# EAGLE design LuMini_1Inch (EAGLE 9.1.0)
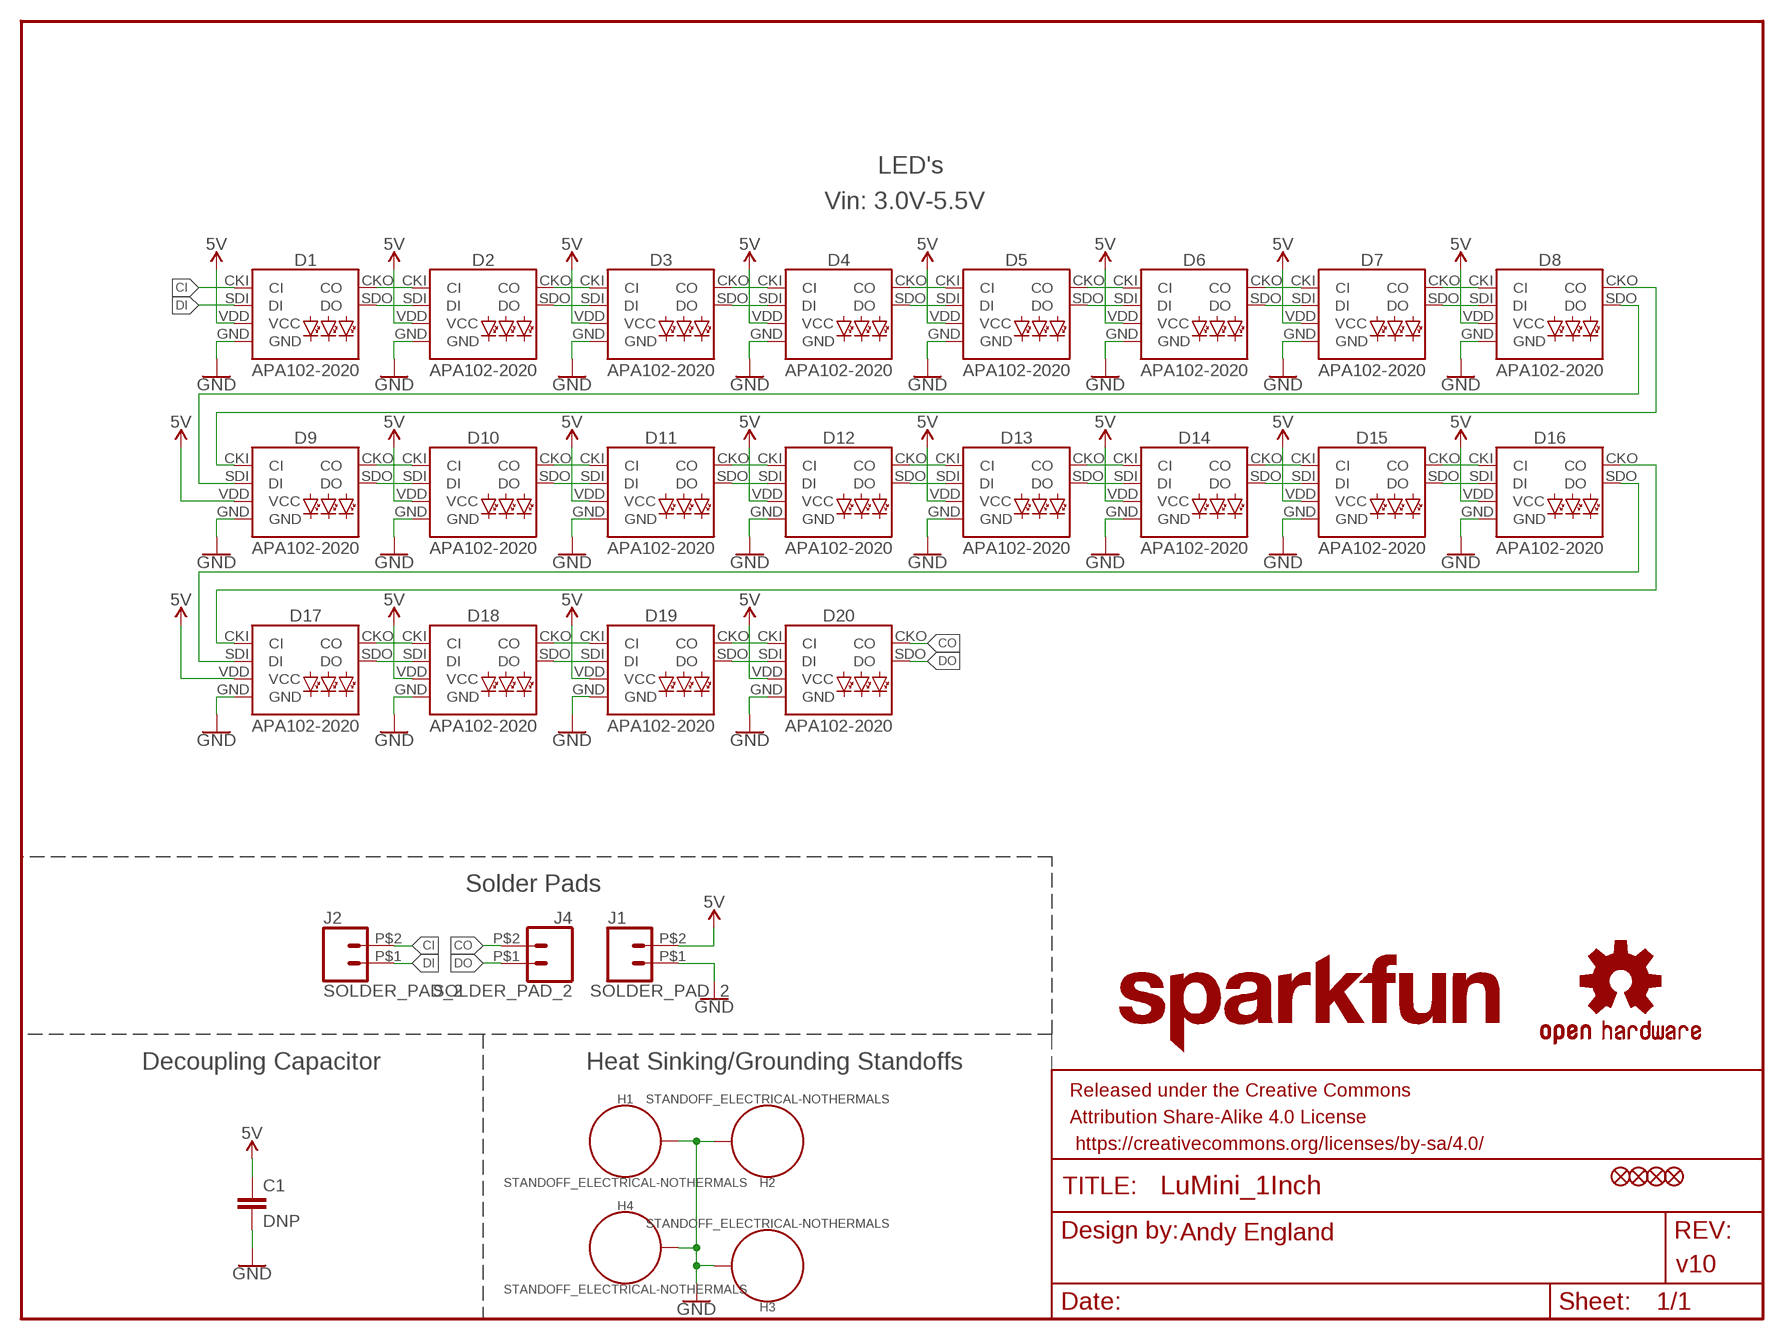
[diagram p0: schematic, sheet 1]

## Parts
C1  DNP  4.7UF-0603-6.3V-(10%)  [0603]
D1  APA102-2020  [APA102-2020]
D2  APA102-2020  [APA102-2020]
D3  APA102-2020  [APA102-2020]
D4  APA102-2020  [APA102-2020]
D5  APA102-2020  [APA102-2020]
D6  APA102-2020  [APA102-2020]
D7  APA102-2020  [APA102-2020]
D8  APA102-2020  [APA102-2020]
D9  APA102-2020  [APA102-2020]
D10  APA102-2020  [APA102-2020]
D11  APA102-2020  [APA102-2020]
D12  APA102-2020  [APA102-2020]
D13  APA102-2020  [APA102-2020]
D14  APA102-2020  [APA102-2020]
D15  APA102-2020  [APA102-2020]
D16  APA102-2020  [APA102-2020]
D17  APA102-2020  [APA102-2020]
D18  APA102-2020  [APA102-2020]
D19  APA102-2020  [APA102-2020]
D20  APA102-2020  [APA102-2020]
FD1  FIDUCIALUFIDUCIAL  [FIDUCIAL-MICRO]
FD2  FIDUCIALUFIDUCIAL  [FIDUCIAL-MICRO]
FD3  FIDUCIALUFIDUCIAL  [FIDUCIAL-MICRO]
FD4  FIDUCIALUFIDUCIAL  [FIDUCIAL-MICRO]
FRAME1  FRAME-LETTER  [CREATIVE_COMMONS]
H1  STANDOFF_ELECTRICAL-NOTHERMALS  [STANDOFF-ELECTRICAL-NOTHERMALS]
H2  STANDOFF_ELECTRICAL-NOTHERMALS  [STANDOFF-ELECTRICAL-NOTHERMALS]
H3  STANDOFF_ELECTRICAL-NOTHERMALS  [STANDOFF-ELECTRICAL-NOTHERMALS]
H4  STANDOFF_ELECTRICAL-NOTHERMALS  [STANDOFF-ELECTRICAL-NOTHERMALS]
J1  SOLDER_PAD_2  [SOLDER_PAD_2]
J2  SOLDER_PAD_2  [SOLDER_PAD_2]
J4  SOLDER_PAD_2  [SOLDER_PAD_2]
LOGO1  SFE_LOGO_NAME.1_INCH  [SFE_LOGO_NAME_.1]
LOGO2  OSHW-LOGOS  [OSHW-LOGO-S]

## Nets
5V: C1.1 D1.VDD(VCC) D2.VDD(VCC) D3.VDD(VCC) D4.VDD(VCC) D5.VDD(VCC) D6.VDD(VCC) D7.VDD(VCC) D8.VDD(VCC) D9.VDD(VCC) D10.VDD(VCC) D11.VDD(VCC) D12.VDD(VCC) D13.VDD(VCC) D14.VDD(VCC) D15.VDD(VCC) D16.VDD(VCC) D17.VDD(VCC) D18.VDD(VCC) D19.VDD(VCC) D20.VDD(VCC) J1.P$2
CI: D1.CKI(CI) J2.P$2
CO: D20.CKO(CO) J4.P$2
DI: D1.SDI(DI) J2.P$1
DO: D20.SDO(DO) J4.P$1
GND: C1.2 D1.GND D2.GND D3.GND D4.GND D5.GND D6.GND D7.GND D8.GND D9.GND D10.GND D11.GND D12.GND D13.GND D14.GND D15.GND D16.GND D17.GND D18.GND D19.GND D20.GND H1.P1 H2.P1 H3.P1 H4.P1 J1.P$1
N$1: D4.CKO(CO) D5.CKI(CI)
N$4: D1.CKO(CO) D2.CKI(CI)
N$5: D1.SDO(DO) D2.SDI(DI)
N$6: D2.CKO(CO) D3.CKI(CI)
N$7: D2.SDO(DO) D3.SDI(DI)
N$8: D3.CKO(CO) D4.CKI(CI)
N$9: D3.SDO(DO) D4.SDI(DI)
N$10: D4.SDO(DO) D5.SDI(DI)
N$11: D5.CKO(CO) D6.CKI(CI)
N$12: D5.SDO(DO) D6.SDI(DI)
N$13: D6.CKO(CO) D7.CKI(CI)
N$14: D6.SDO(DO) D7.SDI(DI)
N$15: D7.CKO(CO) D8.CKI(CI)
N$16: D7.SDO(DO) D8.SDI(DI)
N$17: D8.CKO(CO) D9.CKI(CI)
N$18: D8.SDO(DO) D9.SDI(DI)
N$19: D9.CKO(CO) D10.CKI(CI)
N$20: D9.SDO(DO) D10.SDI(DI)
N$21: D10.CKO(CO) D11.CKI(CI)
N$22: D10.SDO(DO) D11.SDI(DI)
N$23: D11.CKO(CO) D12.CKI(CI)
N$24: D11.SDO(DO) D12.SDI(DI)
N$25: D12.CKO(CO) D13.CKI(CI)
N$26: D12.SDO(DO) D13.SDI(DI)
N$27: D13.CKO(CO) D14.CKI(CI)
N$28: D13.SDO(DO) D14.SDI(DI)
N$29: D14.CKO(CO) D15.CKI(CI)
N$30: D14.SDO(DO) D15.SDI(DI)
N$31: D15.CKO(CO) D16.CKI(CI)
N$32: D15.SDO(DO) D16.SDI(DI)
N$33: D16.CKO(CO) D17.CKI(CI)
N$34: D16.SDO(DO) D17.SDI(DI)
N$35: D17.CKO(CO) D18.CKI(CI)
N$36: D17.SDO(DO) D18.SDI(DI)
N$37: D18.CKO(CO) D19.CKI(CI)
N$38: D18.SDO(DO) D19.SDI(DI)
N$39: D19.CKO(CO) D20.CKI(CI)
N$40: D19.SDO(DO) D20.SDI(DI)

## Notes on the sheet
- LED's
- Vin: 3.0V-5.5V
- Solder Pads
- Decoupling Capacitor | Heat Sinking/Grounding Standoffs
- Andy England
- v10

## Library data of the parts
C1 = SparkFun-Capacitors:4.7UF: 4.7µF ceramic capacitors A capacitor is a passive two-terminal electrical component used to store electrical energy temporarily in an electric field.; PROD_ID: CAP-08280; VALUE: 4.7uF
D1-D20 = SparkFun-LED:APA102: APA102 Addressable RGB LED Used in manufacturing of various products at SparkFun Packages: 5050 2020 SparkFun Products: SparkFun Lumenati Boards <https://www.sparkfun.com/categories/405>; PROD_ID: DIO-13883
FD1-FD4 = SparkFun-Aesthetics:FIDUCIAL: Fiducial Alignment Points Point-of-reference for pick-and-place machines and other optical instruments.
FRAME1 = SparkFun-Aesthetics:FRAME-LETTER: Schematic Frame - Letter Standard 8.5x11 US Letter frame
H1-H4 = SparkFun-Hardware:STANDOFF_ELECTRICAL: Stand Off Drill holes with an electrical connection. For example, use these to ground your board to a chassis. Example SparkFun Products Screw - Phillips Head (1/4", 4-40, 10 pack) <https://www.sparkfun.com/products/10453> (PRT-10453) Screw - Phillips Head (1/2", 4-40, 10 pack) <https://www.sparkfun.com/products/10452> (PRT-10452) Screw - Phillips Head (3/4", 4-40, 10 pack) <https://www.sparkfun.com/products/10451> (PRT-10451) Screw - Phillips Head (1", 4-40, 10 pack) <https://www.sparkfun.com/products/10450> (PRT-10450)
J1 J2 J4 = SparkFun-Connectors:SOLDER_PAD_2: Solder Pad for LuMini Rings
LOGO1 = SparkFun-Aesthetics:SFE_LOGO_NAME: SparkFun Font Logo This is the SparkFun name logo. The logo on the schematic will always be the same size; the package variant is the height of the flame part of the logo (or the height the flame would be, if it were drawn). Default layer for the logo on the board is tSilk.
LOGO2 = SparkFun-Aesthetics:OSHW-LOGO: Open-Source Hardware (OSHW) Logo This logo indicates the piece of hardware it is found on incorporates a OSHW license and/or adheres to the definition of open source hardware found here: http://freedomdefined.org/OSHW

## Board
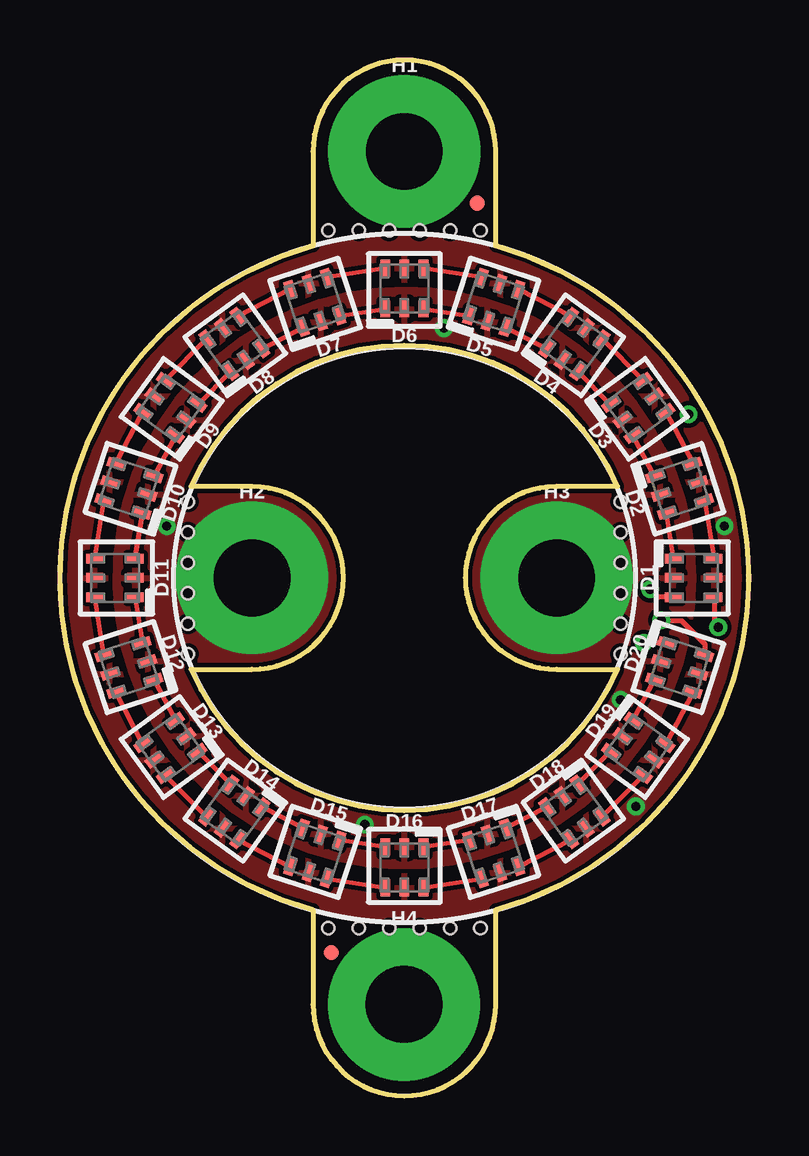
[diagram p1: board, top side]
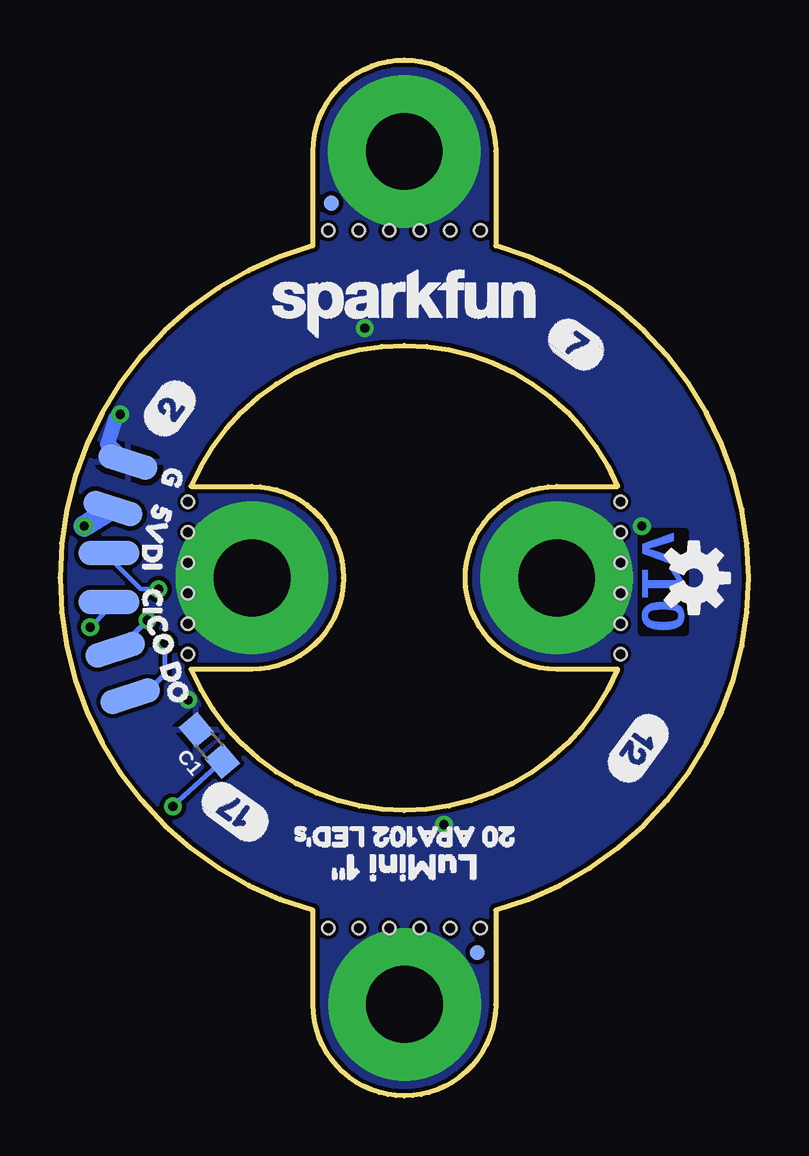
[diagram p2: board, bottom side, seen from below]

Size 28.72 x 43.18 mm. Coordinates in mm from the lower left corner, seen from the top.
Outline: 5.47,17.78 8.01,17.78 arc90 11.82,21.59 arc90 8.01,25.4 5.47,25.4 arc-134 23.25,25.4 20.71,25.4 arc90 16.9,21.59 arc90 20.71,17.78 23.25,17.78 arc-134 5.47,17.78
Outline: 18.17,35.43 18.17,39.37 arc90 14.36,43.18 arc90 10.55,39.37 10.55,35.43 arc149 10.55,7.75 10.55,3.81 arc90 14.36,0 arc90 18.17,3.81 18.17,7.75 arc149 18.17,35.43
Copper layers (1*16): Top 0.035mm / dielectric 1.5mm / Bottom 0.035mm
Design rules "SparkFun-2-layer-TIGHT": minimum track width 7mil, minimum drill 15mil, track to track 7mil, track to pad 7mil, pad to pad 7mil, via to via 7mil, smd to smd 7mil, copper to edge 7mil, drill to drill 7mil, minimum pad ring 7mil, minimum via ring 7mil, stop-mask expansion 4mil, vias tented up to drill 25mil, thermal gap 10mil
Holes 0.51 mm at 5.34,18.41 5.34,19.68 5.34,20.95 5.34,22.23 5.34,23.5 5.34,24.77 23.37,18.41 23.37,19.68 23.37,20.95 23.37,22.23 23.37,23.5 23.37,24.77 17.53,6.99 16.26,6.99 14.99,6.99 13.72,6.99 12.45,6.99 11.18,6.99 17.53,36.07 16.26,36.07 14.99,36.07 13.72,36.07 12.45,36.07 11.18,36.07

### Footprints (pad centres in the part's own frame; a part is rotated, then mirrored left to right if it is on the bottom)
0603 = smd 1.1 x 1: 1 -0.85,0; 2 0.85,0
APA102-2020 = smd 0.4 x 0.7: CKI -0.8,-0.85; CKO 0.8,-0.85; GND 0,0.85; SDI -0.8,0.85; SDO 0.8,0.85; VDD 0,-0.85
FIDUCIAL-MICRO = smd 0.635 x 0.635: 1 0,0
STANDOFF-ELECTRICAL-NOTHERMALS = drill 3.2 pad 6.35: P1 0,0
SOLDER_PAD_2 = smd 1.016 x 2.54: P$1 -1.016,0; P$2 1.016,0

### Placement (x,y rotation side)
C1  22.49,14.61 130 bottom
D1  26.42,21.59 90 top
D2  25.84,25.32 108 top
D3  24.11,28.68 126 top
D4  21.44,31.34 144 top
D5  18.09,33.07 162 top
D6  14.36,33.66 180 top
D7  10.62,33.07 198 top
D8  7.27,31.34 216 top
D9  4.6,28.68 234 top
D10  2.88,25.32 252 top
D11  2.29,21.59 270 top
D12  2.88,17.86 288 top
D13  4.6,14.5 306 top
D14  7.27,11.84 324 top
D15  10.62,10.11 342 top
D16  14.36,9.53 0 top
D17  18.09,10.11 18 top
D18  21.44,11.84 36 top
D19  24.11,14.5 54 top
D20  25.84,17.86 72 top
FD1  11.31,5.97 0 top
FD2  11.31,5.97 0 bottom
FD3  17.41,37.21 0 top
FD4  17.41,37.21 0 bottom
FRAME1  -10.41,-6.35 0 top  (outside the outline)
H1  14.36,39.37 0 top
H2  8.01,21.59 0 top
H3  20.71,21.59 0 top
H4  14.35,3.81 0 top
J1  26.19,25.45 252 bottom
J2  26.68,21.6 270 bottom
J4  26.11,17.63 108 bottom
LOGO1  14.36,33.02 0 bottom
LOGO2  2.29,21.59 270 bottom
U$2  [20_APA102_LED#S6]  9.02,10.79 180 bottom
U$3  [20]  24.92,27.57 54 bottom
U$4  [5V6]  24.16,25.26 252 bottom
U$5  [G4]  23.67,26.85 252 bottom
U$6  [71]  8.25,32.08 324 bottom
U$7  [DO3]  24.4,18.73 288 bottom
U$8  [CO1]  25,20.69 288 bottom
U$9  [CI6]  24.85,21.88 270 bottom
U$10  [DI4]  24.86,23.74 270 bottom
U$11  [122]  3.65,15.8 234 bottom
U$12  [173]  20.14,10.91 144 bottom
U$13  [ORDERING_INSTRUCTIONS]  -10.41,-7.62 0 top  (outside the outline)
U$14  [LUMINI_1#1]  10.42,9.53 180 bottom

### Tracks (layer width: path | path; a pad name or v marks a point on that pad's centre or on a via)
5V  (via drill 0.38)
  Bottom 0.203: C1.1 v24.01,12.06
  Bottom 0.889: J1.P$2 v27.7,23.75
  pour Top (rank 2): 14.36,35.94 arc90 0.01,21.59 arc90 14.36,7.24 arc90 28.71,21.59 arc90
CI  (via drill 0.38)
  Top 0.203: v27.45,19.53 27.27,19.58 D1.CKI
  Bottom 0.178: v27.45,19.53 26.68,20.31 J2.P$2
CO  (via drill 0.38)
  Top 0.203: v25.07,19.82 25.08,19.81 25.91,19.81 26.89,18.83 D20.CKO
  Bottom 0.203: J4.P$2 26.3,18.59 v25.07,19.82
DI  (via drill 0.38)
  Top 0.203: D1.SDI 24.94,20.79 v24.61,21.12
  Bottom 0.178: v24.61,21.12 25.34,21.12 26.75,22.53 26.68,22.61 J2.P$1
DO  (via drill 0.38)
  Top 0.203: D20.SDO v24.34,18.88
  Bottom 0.203: J4.P$1 25.26,16.66 24.34,17.58 v24.34,18.88
GND  (via drill 0.38)
  Bottom 0.635: v26.21,28.41 26.4,28.21 26.73,27.16 25.94,26.42 J1.P$1
  other vias: 12.71,11.3 4.45,23.75 16.01,32 23.37,16.51
  pour Top: 14.36,33.66 arc-90 26.42,21.59 arc-270
  pour Bottom: 14.42,35.94 arc-90 28.74,21.62 arc-90 14.36,7.24 arc-90 0.04,21.56 arc-90
  pour Bottom: 18.17,7.75 18.17,3.81 arc-90 14.36,0 arc-90 10.55,3.81 10.55,7.75
  pour Bottom: 18.17,35.43 18.17,39.37 arc90 14.36,43.18 arc90 10.55,39.37 10.55,35.43
N$1
  Top 0.178: D4.CKO D5.CKI
N$4
  Top 0.178: D2.CKI D1.CKO
N$5
  Top 0.178: D1.SDO D2.SDI
N$6
  Top 0.178: D3.CKI D2.CKO
N$7
  Top 0.178: D2.SDO D3.SDI
N$8
  Top 0.178: D3.CKO D4.CKI
N$9
  Top 0.178: D4.SDI D3.SDO
N$10
  Top 0.178: D5.SDI D4.SDO
N$11
  Top 0.178: D6.CKI D5.CKO
N$12
  Top 0.178: D5.SDO D6.SDI
N$13
  Top 0.178: D6.CKO D7.CKI
N$14
  Top 0.178: D7.SDI D6.SDO
N$15
  Top 0.178: D7.CKO D8.CKI
N$16
  Top 0.178: D8.SDI D7.SDO
N$17
  Top 0.178: D8.CKO D9.CKI
N$18
  Top 0.178: D9.SDI D8.SDO
N$19
  Top 0.178: D9.CKO D10.CKI
N$20
  Top 0.178: D10.SDI D9.SDO
N$21
  Top 0.178: D10.CKO D11.CKI
N$22
  Top 0.203: D11.SDI D10.SDO
N$23
  Top 0.178: D12.CKI D11.CKO
N$24
  Top 0.178: D11.SDO D12.SDI
N$25
  Top 0.178: D12.CKO D13.CKI
N$26
  Top 0.178: D12.SDO D13.SDI
N$27
  Top 0.178: D14.CKI D13.CKO
N$28
  Top 0.178: D13.SDO D14.SDI
N$29
  Top 0.178: D14.CKO D15.CKI
N$30
  Top 0.178: D15.SDI D14.SDO
N$31
  Top 0.178: D15.CKO D16.CKI
N$32
  Top 0.178: D16.SDI D15.SDO
N$33
  Top 0.178: D16.CKO D17.CKI
N$34
  Top 0.178: D17.SDI D16.SDO
N$35
  Top 0.178: D18.CKI D17.CKO
N$36
  Top 0.178: D17.SDO D18.SDI
N$37
  Top 0.178: D19.CKI D18.CKO
N$38
  Top 0.178: D19.SDI D18.SDO
N$39
  Top 0.178: D20.CKI D19.CKO
N$40
  Top 0.178: D19.SDO D20.SDI

### Text on the board
Bottom: v10
tDocu: Black PCB / 2 Oz. Copper